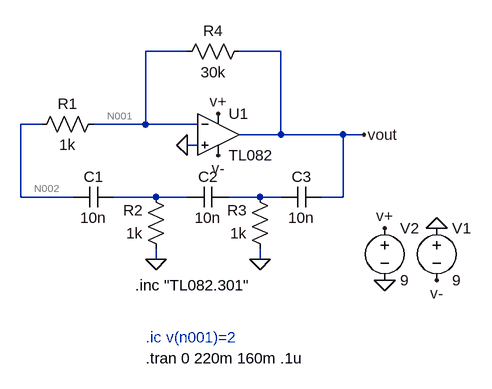
[diagram p0: schematic oscfase.asc]
oscfase.asc, the LTspice schematic file:
Version 4
SHEET 1 880 680
WIRE 320 -16 256 -16
WIRE 464 -16 400 -16
WIRE 96 96 64 96
WIRE 256 96 256 -16
WIRE 256 96 176 96
WIRE 336 96 256 96
WIRE 464 112 464 -16
WIRE 464 112 400 112
WIRE 560 112 464 112
WIRE 592 112 560 112
WIRE 336 128 320 128
WIRE 64 208 64 96
WIRE 144 208 64 208
WIRE 272 208 208 208
WIRE 320 208 272 208
WIRE 432 208 384 208
WIRE 464 208 432 208
WIRE 560 208 560 112
WIRE 560 208 528 208
WIRE 272 304 272 288
WIRE 432 304 432 288
FLAG 272 304 0
FLAG 432 304 0
FLAG 320 128 0
FLAG 592 112 vout
FLAG 624 256 v+
FLAG 368 80 v+
FLAG 704 336 v-
FLAG 368 144 v-
FLAG 624 336 0
FLAG 704 256 0
SYMBOL res 192 80 R90
WINDOW 0 0 56 VBottom 2
WINDOW 3 32 56 VTop 2
SYMATTR InstName R1
SYMATTR Value 1k
SYMBOL res 288 304 R180
WINDOW 0 36 76 Left 2
WINDOW 3 36 40 Left 2
SYMATTR InstName R2
SYMATTR Value 1k
SYMBOL res 448 304 R180
WINDOW 0 36 76 Left 2
WINDOW 3 36 40 Left 2
SYMATTR InstName R3
SYMATTR Value 1k
SYMBOL cap 208 192 R90
WINDOW 0 0 32 VBottom 2
WINDOW 3 32 32 VTop 2
SYMATTR InstName C1
SYMATTR Value 10n
SYMBOL cap 384 192 R90
WINDOW 0 0 32 VBottom 2
WINDOW 3 32 32 VTop 2
SYMATTR InstName C2
SYMATTR Value 10n
SYMBOL cap 528 192 R90
WINDOW 0 0 32 VBottom 2
WINDOW 3 32 32 VTop 2
SYMATTR InstName C3
SYMATTR Value 10n
SYMBOL res 416 -32 R90
WINDOW 0 0 56 VBottom 2
WINDOW 3 32 56 VTop 2
SYMATTR InstName R4
SYMATTR Value 30k
SYMBOL Opamps\\UniversalOpamp2 368 112 R0
SYMATTR InstName U1
SYMATTR SpiceModel ""
SYMATTR Value2 ""
SYMATTR SpiceLine ""
SYMATTR SpiceLine2 ""
SYMATTR Value TL082
SYMBOL voltage 704 240 R0
WINDOW 123 0 0 Left 0
WINDOW 39 0 0 Left 0
SYMATTR InstName V1
SYMATTR Value 9
SYMBOL voltage 624 240 R0
WINDOW 123 0 0 Left 0
WINDOW 39 0 0 Left 0
SYMATTR InstName V2
SYMATTR Value 9
TEXT 240 344 Left 2 !.inc "TL082.301"
TEXT 256 424 Left 2 ;.ic v(n001)=2
TEXT 256 456 Left 2 !.tran 0 220m 160m .1u

The netlist it stands for:
* oscfase.asc
R1 N001 N002 1k
R2 0 N003 1k
R3 0 N004 1k
C1 N003 N002 10n
C2 N004 N003 10n
C3 vout N004 10n
R4 vout N001 30k
XU1 0 N001 v+ v- vout TL082  ; pins IN+ IN- V+ V- OUT
V1 0 v- 9
V2 v+ 0 9
.inc "TL082.301"
* .ic v(n001)=2
.tran 0 220m 160m .1u
.lib UniversalOpamps2.sub
.backanno
.end

* Results of the author's LTspice run, read from the files saved beside the schematic
* Operating Point, zero values left out:
*   V(n001) = 10.97 µV
*   V(n002) = 10.97 µV
*   V(vout) = 12.1 µV
*   V(v-) = -9 V
*   V(v+) = 9 V
*   I(R4) = 39.05 pA
*   I(V2) = -8.594 mA
*   I(V1) = -8.595 mA
*   Ix(u1:1) = 39.05 pA
*   Ix(u1:2) = 39.05 pA
*   Ix(u1:3) = 8.594 mA
*   Ix(u1:4) = -8.595 mA
*   Ix(u1:5) = -39.05 pA